# EAGLE schematic CMOS_MUSIC_I Schematic 2016 Edition (EAGLE 7.3.0)

## Sheet 1 of 2
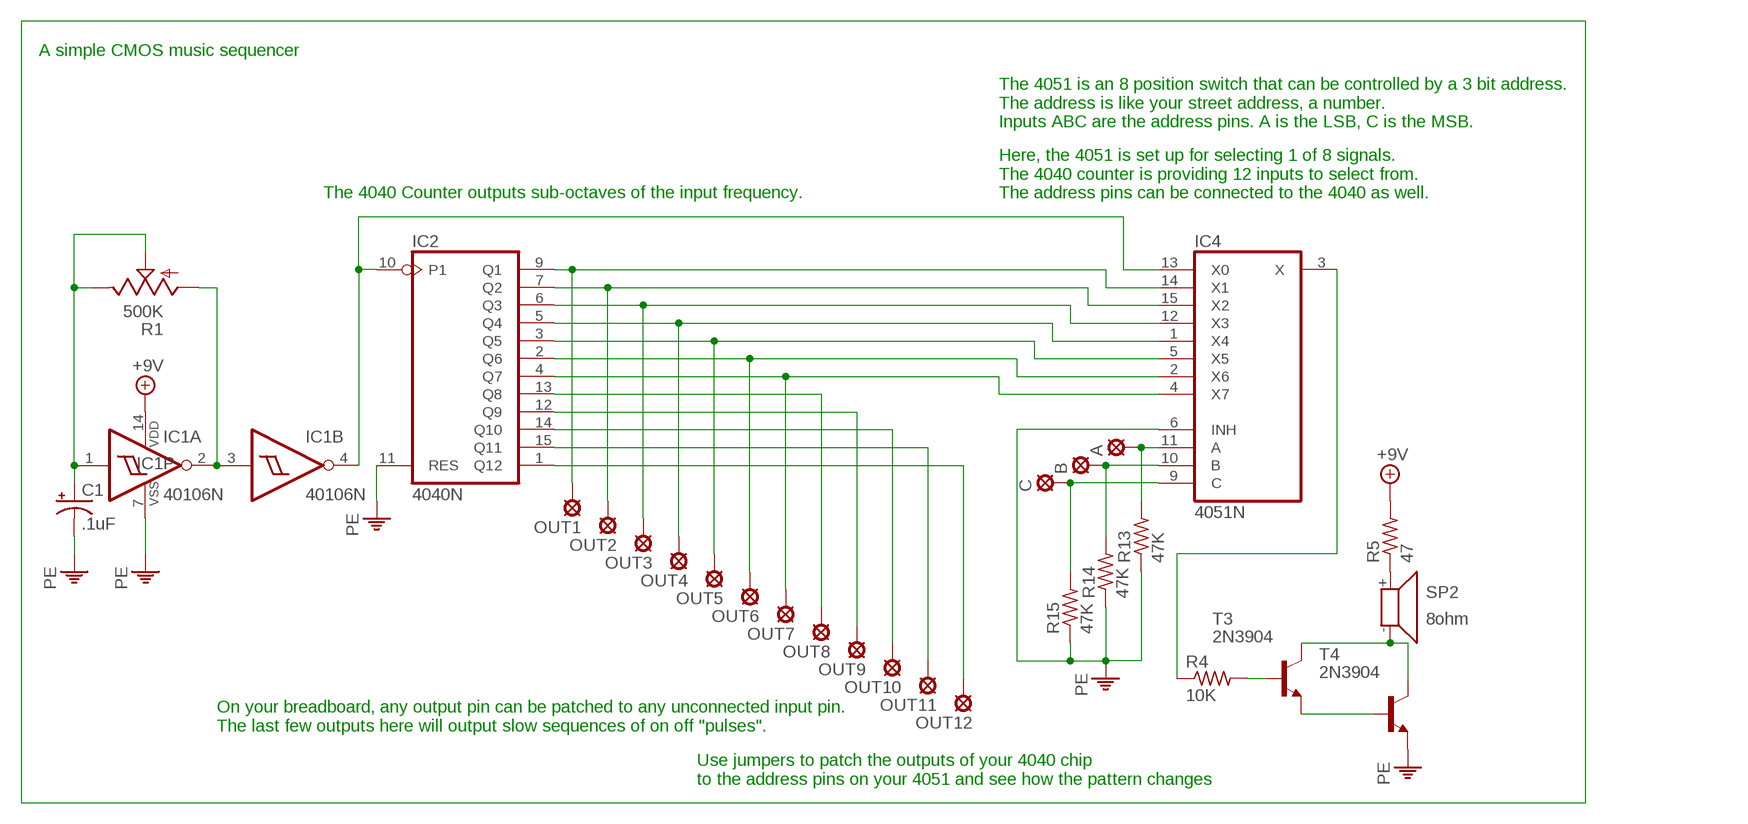
[diagram p0: schematic, sheet 1]

### Parts
A  MCS10B  [MCS10B]
B  MCS10B  [MCS10B]
C  MCS10B  [MCS10B]
C1  .1uF  CPOL-USE2,5-6E  [E2,5-6E]
IC1  40106N  [DIL14]
IC2  4040N  [DIL16]
IC4  4051N  [DIL16]
OUT1  MCS10B  [MCS10B]
OUT2  MCS10B  [MCS10B]
OUT3  MCS10B  [MCS10B]
OUT4  MCS10B  [MCS10B]
OUT5  MCS10B  [MCS10B]
OUT6  MCS10B  [MCS10B]
OUT7  MCS10B  [MCS10B]
OUT8  MCS10B  [MCS10B]
OUT9  MCS10B  [MCS10B]
OUT10  MCS10B  [MCS10B]
OUT11  MCS10B  [MCS10B]
OUT12  MCS10B  [MCS10B]
R1  500K  US-EVUF2A  [EVUF]
R4  10K  R-US_0204/7  [0204/7]
R5  47  R-US_0204/7  [0204/7]
R13  47K  R-US_0204/7  [0204/7]
R14  47K  R-US_0204/7  [0204/7]
R15  47K  R-US_0204/7  [0204/7]
SP2  8ohm  SMS-1308MS-2-R  [SMS-1308MS-2-R]
T3  2N3904  [TO92]
T4  2N3904  [TO92]

### Nets
+9V: IC1.14(P:VDD) R5.2 ; also sheet 2
N$1: IC2.13(Q8) OUT8.MP
N$2: IC2.9(Q1) IC4.14(X1) OUT1.MP
N$3: IC1.2(A:O) IC1.3(B:I) R1.1(A)
N$4: IC2.7(Q2) IC4.15(X2) OUT2.MP
N$5: IC2.6(Q3) IC4.12(X3) OUT3.MP
N$6: IC2.5(Q4) IC4.1(X4) OUT4.MP
N$7: IC2.3(Q5) IC4.5(X5) OUT5.MP
N$8: IC2.2(Q6) IC4.2(X6) OUT6.MP
N$9: IC2.4(Q7) IC4.4(X7) OUT7.MP
N$10: IC2.12(Q9) OUT9.MP
N$11: IC2.14(Q10) OUT10.MP
N$12: IC2.15(Q11) OUT11.MP
N$13: IC2.1(Q12) OUT12.MP
N$20: R5.1 SP2.+
N$21: R4.2 T3.2(B)
N$22: SP2.- T3.1(C) T4.1(C)
N$23: T3.3(E) T4.2(B)
N$28: C1.+ IC1.1(A:I) R1.2(S) R1.3(E)
N$29: IC1.4(B:O) IC2.10(P1) IC4.13(X0)
N$31: C.MP IC4.9(C) R15.2
N$32: B.MP IC4.10(B) R14.2
N$33: A.MP IC4.11(A) R13.2
N$38: IC4.3(X) R4.1
PE: C1.- IC1.7(P:VSS) IC2.11(RES) IC4.6(INH) R13.1 R14.1 R15.1 T4.3(E) ; also sheet 2
Unconnected: IC1.5(C:I) IC1.6(C:O) IC1.8(D:O) IC1.9(D:I) IC1.10(E:O) IC1.11(E:I) IC1.12(F:O) IC1.13(F:I)

### Notes on the sheet
- A simple CMOS music sequencer
- The 4051 is an 8 position switch that can be controlled by a 3 bit address.
  The address is like your street address, a number.
  Inputs ABC are the address pins. A is the LSB, C is the MSB.
- The 4040 Counter outputs sub-octaves of the input frequency.
- Here, the 4051 is set up for selecting 1 of 8 signals.
  The 4040 counter is providing 12 inputs to select from.
  The address pins can be connected to the 4040 as well.
- On your breadboard, any output pin can be patched to any unconnected input pin.
  The last few outputs here will output slow sequences of on off "pulses".
- Use jumpers to patch the outputs of your 4040 chip
  to the address pins on your 4051 and see how the pattern changes

## Sheet 2 of 2
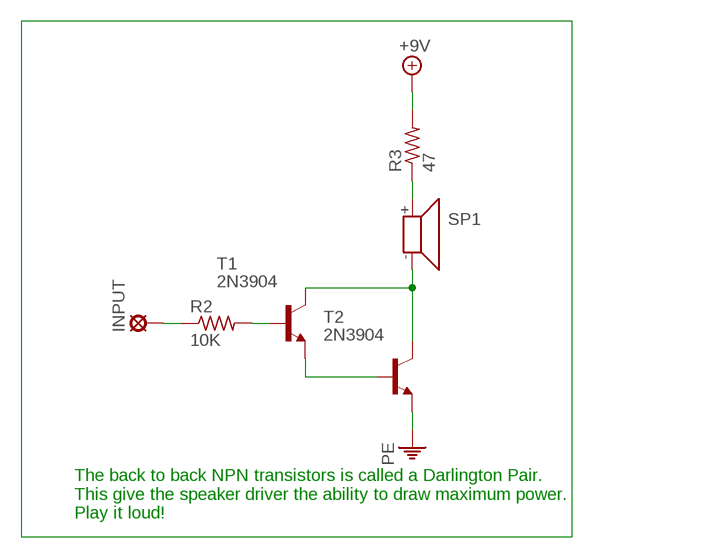
[diagram p1: schematic, sheet 2]

### Parts
INPUT  MCS10B  [MCS10B]
R2  10K  R-US_0204/7  [0204/7]
R3  47  R-US_0204/7  [0204/7]
SP1  SMS-1308MS-2-R  [SMS-1308MS-2-R]
T1  2N3904  [TO92]
T2  2N3904  [TO92]

### Nets
+9V: R3.2 ; also sheet 1
N$14: INPUT.MP R2.1
N$15: R2.2 T1.2(B)
N$16: SP1.- T1.1(C) T2.1(C)
N$17: T1.3(E) T2.2(B)
N$18: R3.1 SP1.+
PE: T2.3(E) ; also sheet 1

### Notes on the sheet
- The back to back NPN transistors is called a Darlington Pair.
  This give the speaker driver the ability to draw maximum power.
  Play it loud!

## Power pins joined to a net without a drawn wire
GND: IC4.8(GND)
VCC: IC4.16(VCC)
VDD: IC2.16(VDD)
VEE: IC4.7(VEE)
VSS: IC2.8(VSS)

## Library data of the parts
A B C INPUT OUT1-OUT12 = solpad:MCS10B: SOLDER PAD MC S1, distributor Buerklin, 15F505
C1 = rcl:CPOL-US: POLARIZED CAPACITOR, American symbol
IC1 = 40xx:40106: Hex SCHMITT TRIGGER
IC2 = 40xx:4040: 12-stage binary/ripple COUNTER
IC4 = 40xx:4051: 8-channel ANALOG MULTIPLEXER
R1 = pot:US-EVU: 9 mm Square Rotary Potentiometers Source: Panasonic
R2-R5 R13-R15 = rcl:R-US_: RESISTOR, American symbol
SP1 SP2 = speaker:SMS-1308MS-2-R: Speaker 13 x 13mm, 8 Ohm, 0.7W Source: pui audio inc. SMS-1308MS-2-R.pdf
T1-T4 = transistor:2N3904: NPN TRANSISTOR